# EasyEDA Pro project PokerV2.epro

# Schematic Schematic2

## Sheets
1 ULN2003: Assembly Variant: Basic; Board Name: version 2; Create Date: 2026-07-25; Page Name: ULN2003; Project Name: poker_v2.0; Schematic Name: Schematic2; Update Date: 2026-07-25; Company: 嘉立创EDA; Page Size: A4; Version: V1.0
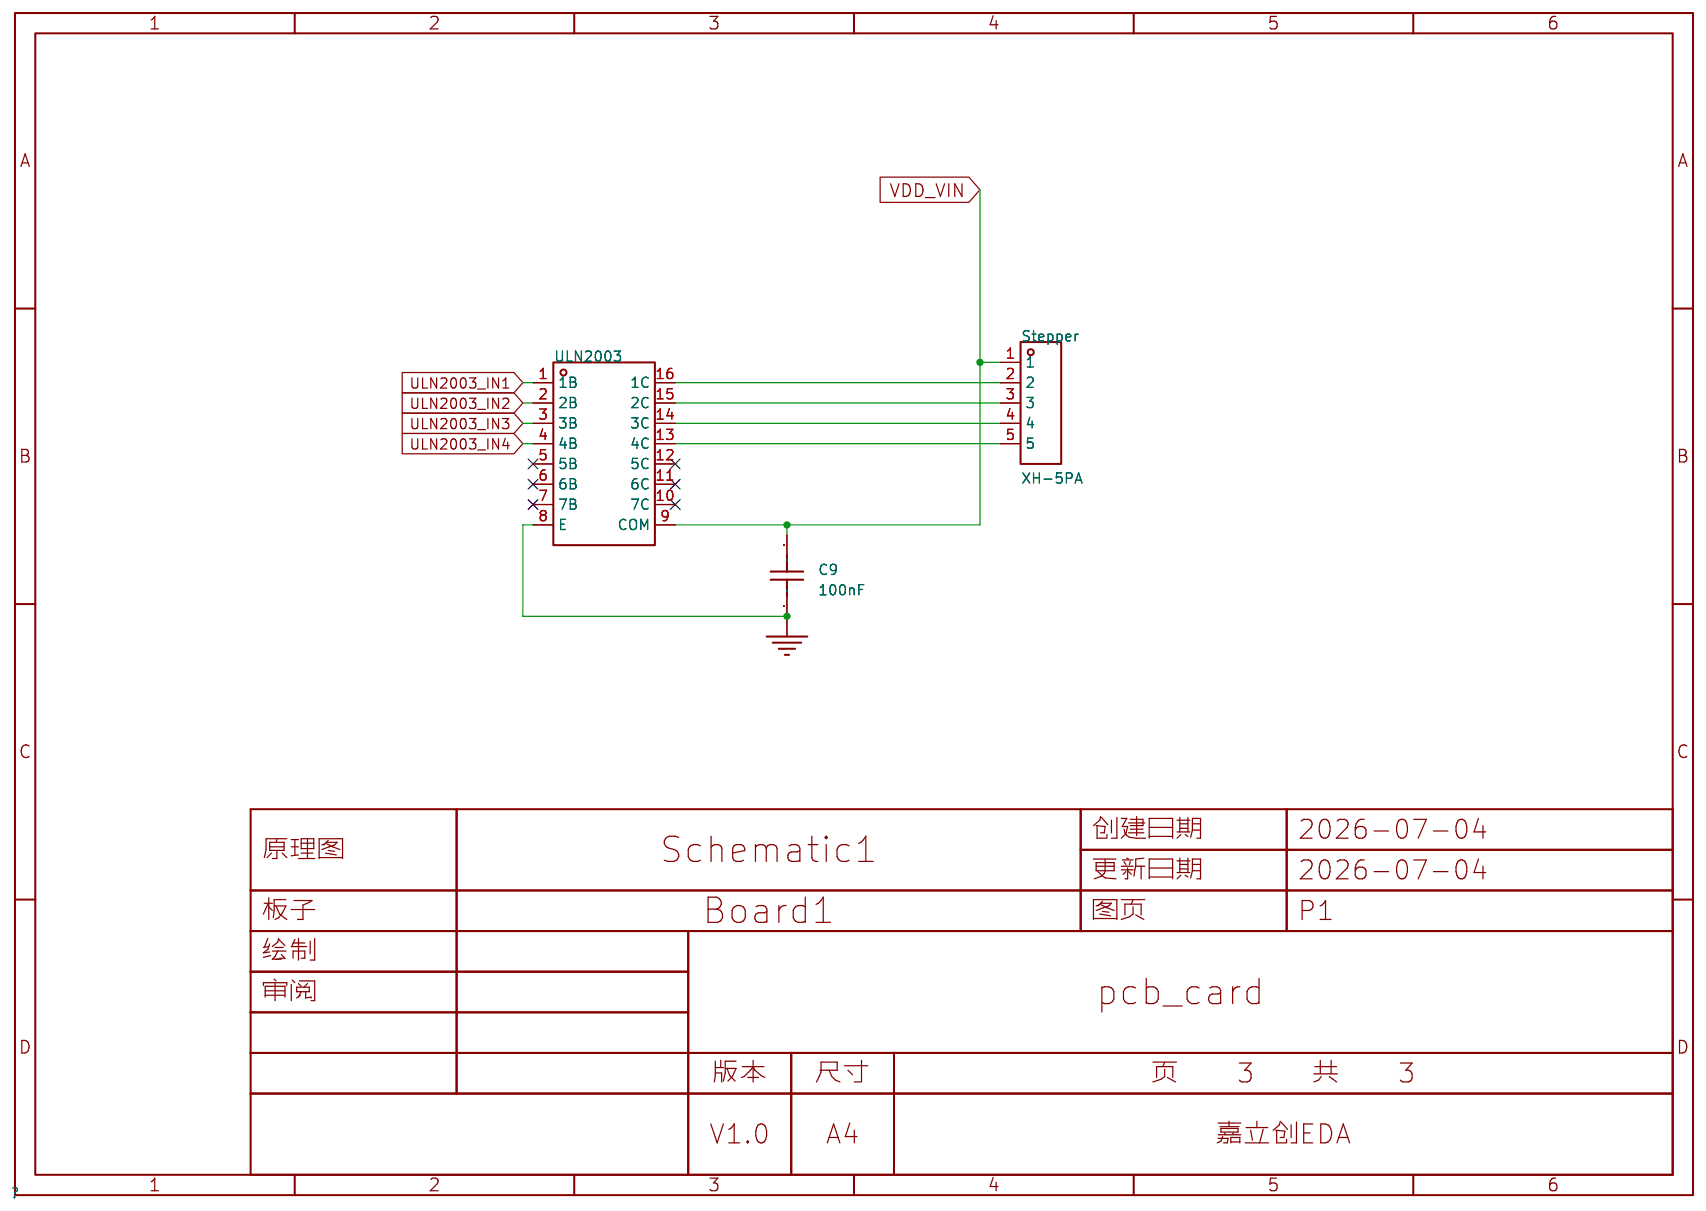
[diagram p0: ULN2003]
2 DRV8833: Page Name: DRV8833; Update Date: 2026-08-29
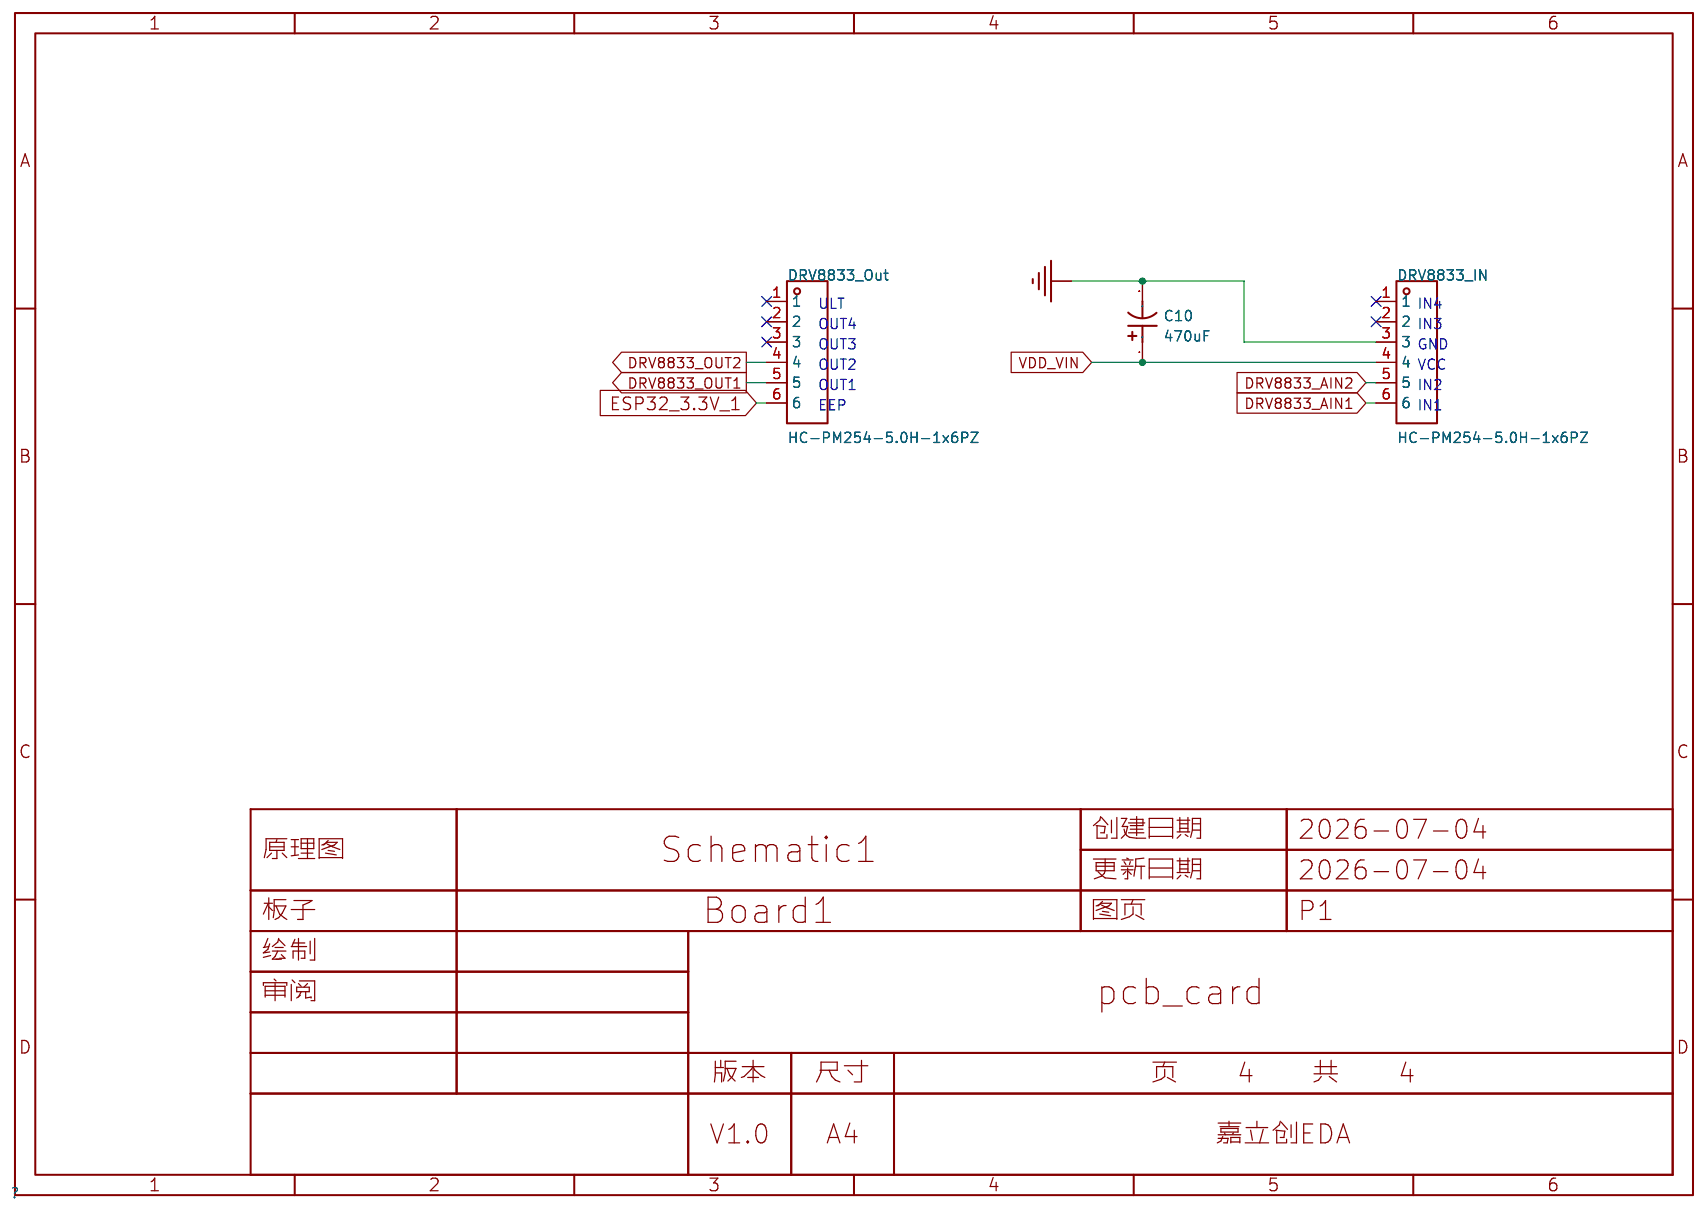
[diagram p1: DRV8833]
3 ESP32-S3N8R2: Page Name: ESP32-S3N8R2; Update Date: 2026-09-03
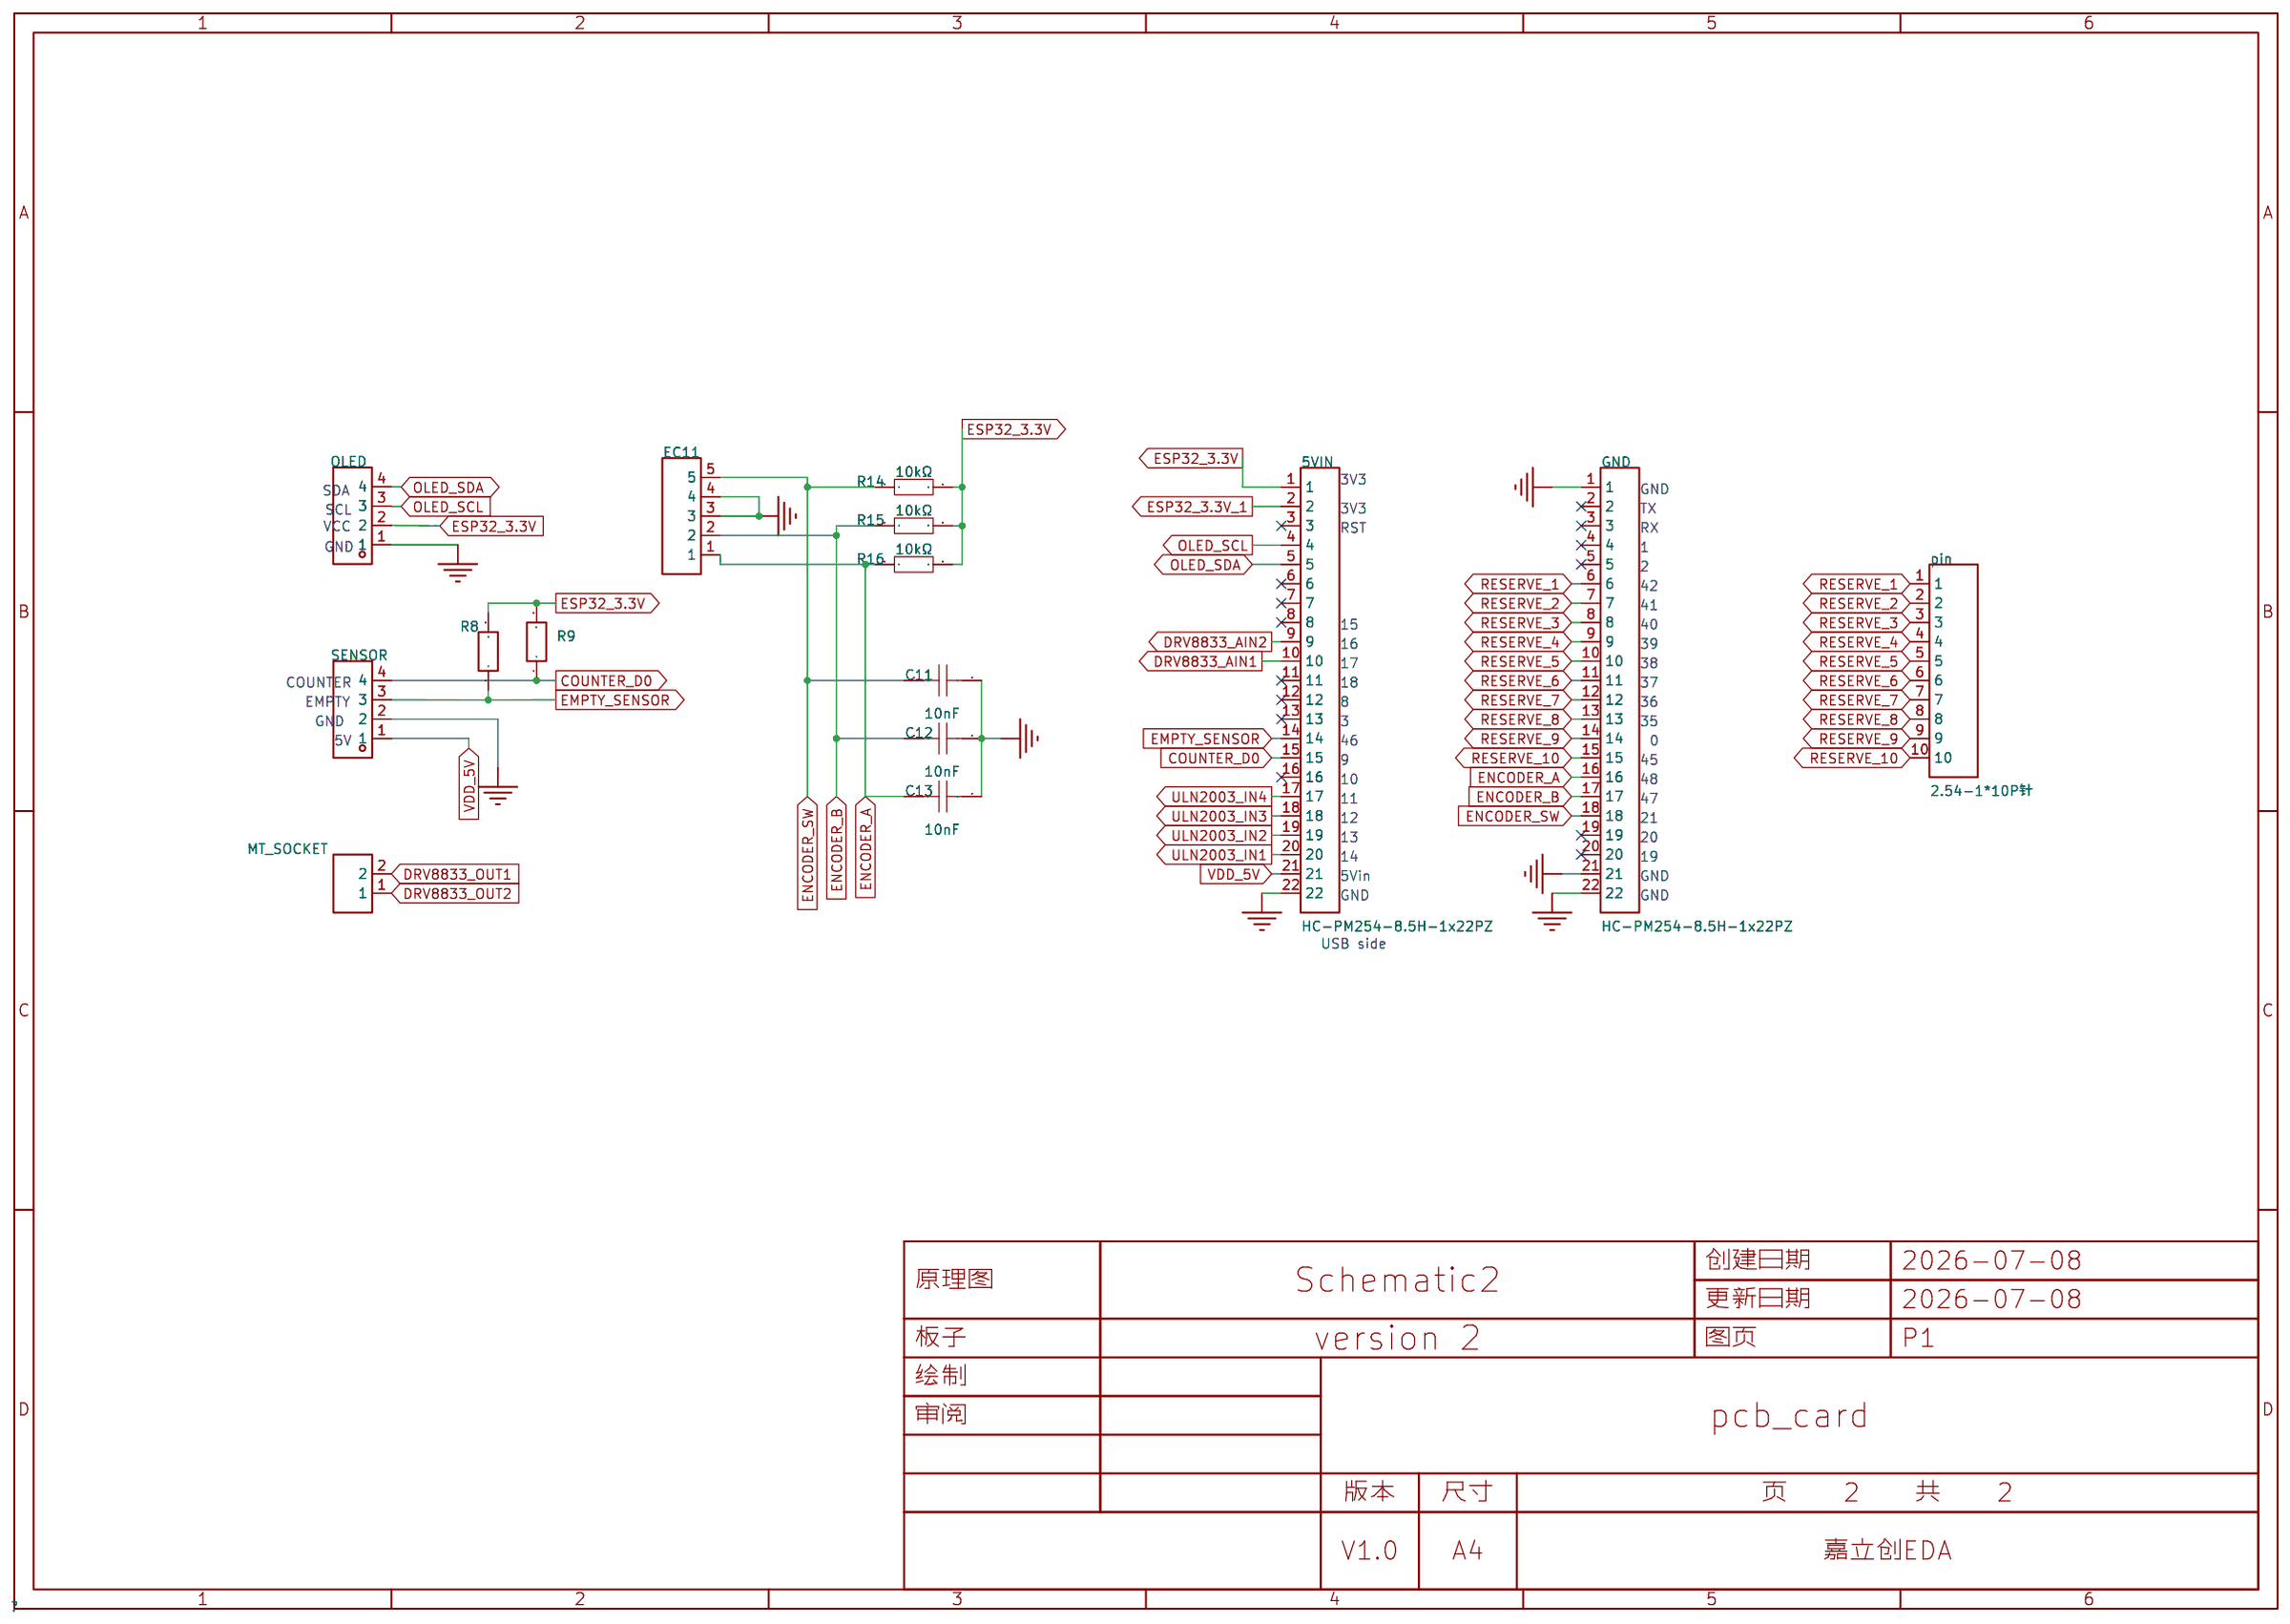
[diagram p2: ESP32-S3N8R2]
4 power: Page Name: power
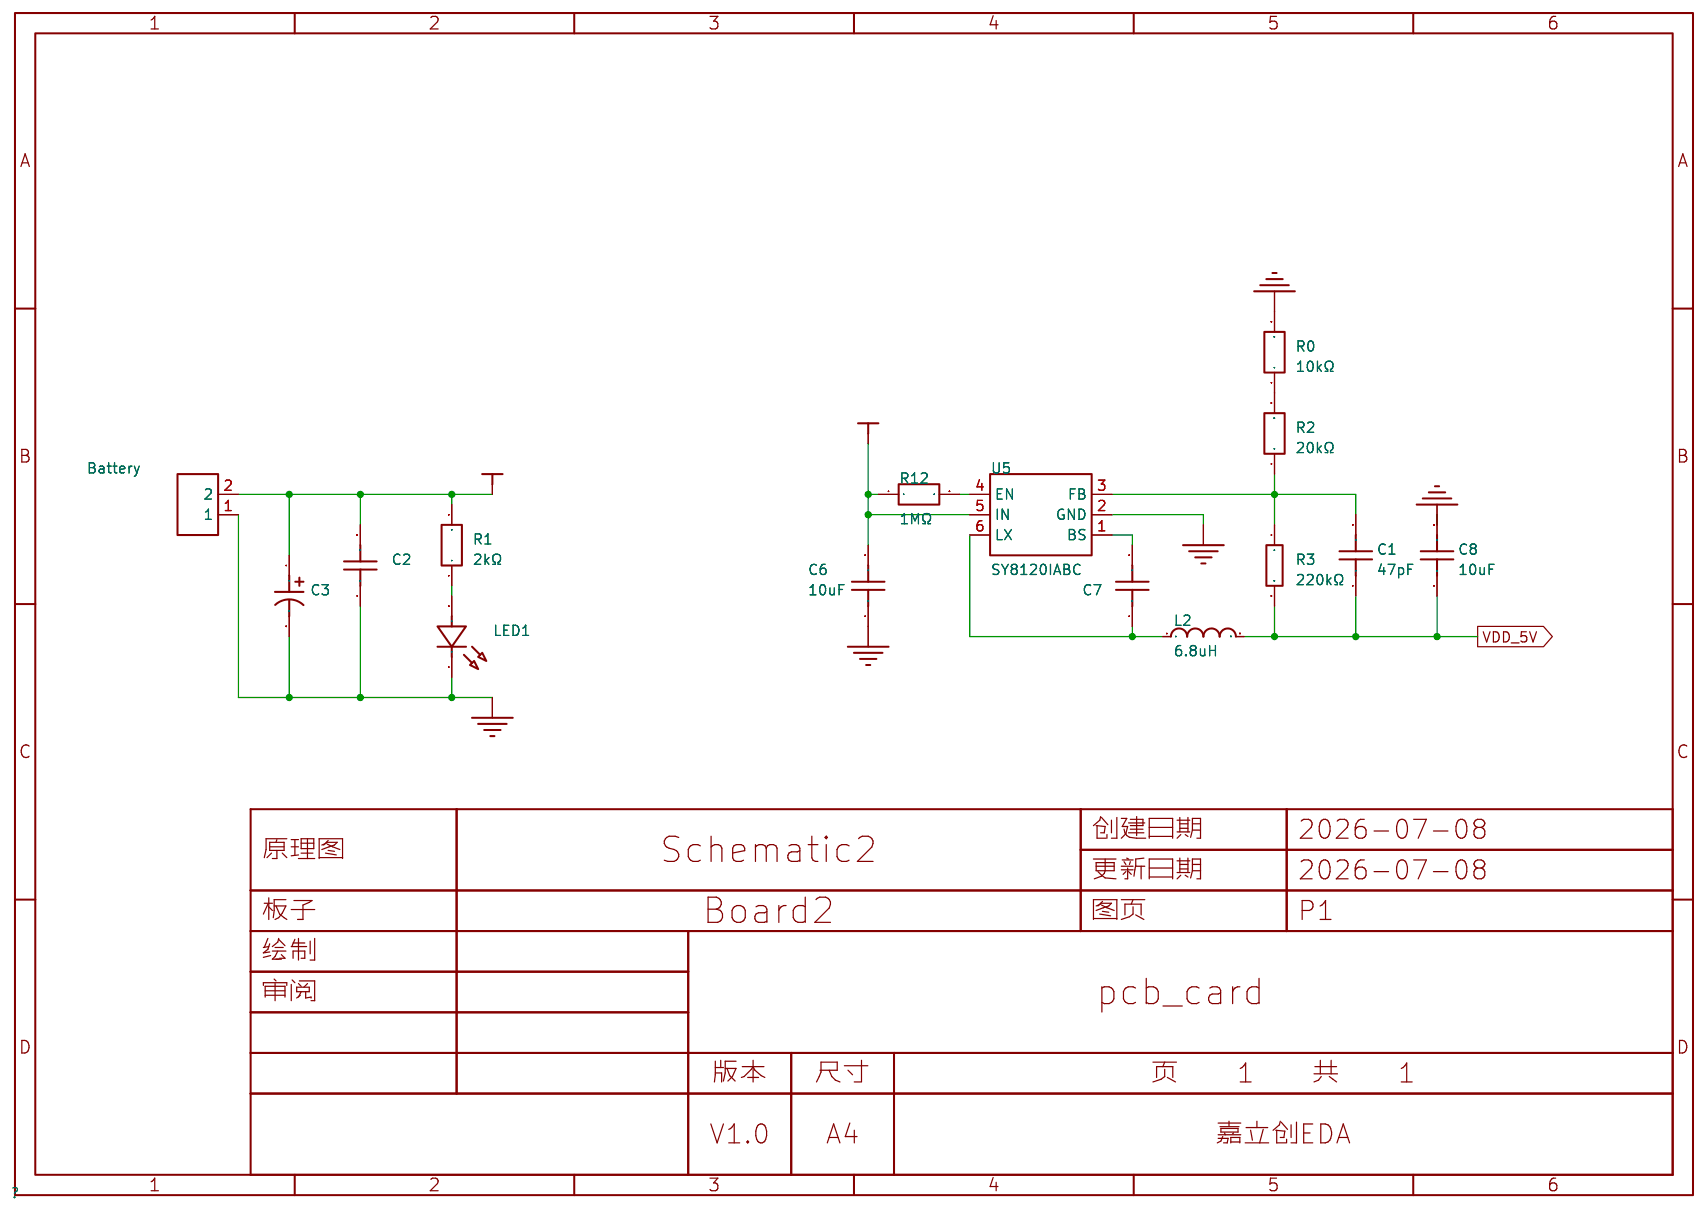
[diagram p3: power]

## Parts
sheet DRV8833
C10  470uF  [CAP-TH_BD8.0-P3.50-D0.6-FD-2]
DRV8833_IN  HC-PM254-5.0H-1x6PZ  [HDR-TH_HC-PM254-5.0H-1X6PZ]
DRV8833_Out  HC-PM254-5.0H-1x6PZ  [HDR-TH_HC-PM254-5.0H-1X6PZ]
sheet ESP32-S3N8R2
5VIN  HC-PM254-8.5H-1x22PZ  [HDR-TH_22P-P2.54-V-F]
C11  10nF  [CAP-TH_L5.8-W3.6-P5.0-D0.6]
C12  10nF  [CAP-TH_L5.8-W3.6-P5.0-D0.6]
C13  10nF  [CAP-TH_L5.8-W3.6-P5.0-D0.6]
EC11  HX-XH2.54-5PZZ  [CONN-TH_5P-P2.50_ZX-XH2.54-5PZZ]
GND  HC-PM254-8.5H-1x22PZ  [HDR-TH_22P-P2.54-V-F]
MT_SOCKET  77311-102-02LF  [HDR-TH_2P-P2.54-V-M-1]
OLED  ZX-XH2.54-4PZZ  [CONN-TH_4P-P2.50_4PIN]
pin  2.54-1*10P针  [HDR-TH_10P-P2.54-V-M-1]
R8  4.7kΩ  [RES-TH_BD2.7-L6.2-P10.20-D0.4]
R9  4.7kΩ  [RES-TH_BD2.7-L6.2-P10.20-D0.4]
R14  10kΩ  [RES-TH_BD2.5-L6.5-P10.50-D0.6]
R15  10kΩ  [RES-TH_BD2.5-L6.5-P10.50-D0.6]
R16  10kΩ  [RES-TH_BD2.5-L6.5-P10.50-D0.6]
SENSOR  ZX-XH2.54-4PZZ  [CONN-TH_4P-P2.50_4PIN]
sheet power
Battery  BX-XH2.54-2PZZ  [CONN-TH_2P-P2.50_BX-XH2.54-2PZZ]
C1  47pF  [CAP-TH_L4.0-W2.6-P2.50-D0.5]
C2  100nF  [CAP-TH_L5.8-W2.4-P2.54-D0.6]
C3  220uF  [CAP-TH_BD6.3-P2.50-D0.5-FD]
C6  10uF  [CAP-TH_L4.0-W2.5-P2.50-D0.5]
C7  100nF  [CAP-TH_L5.8-W2.4-P2.54-D0.6]
C8  10uF  [CAP-TH_L4.0-W2.5-P2.50-D0.5]
L2  6.8uH  [IND-SMD_L5.7-W5.2_GSM0530]
LED1  TLCR5100  [ED-TH_BD5.8-P2.54-R-FD]
R0  10kΩ  [RES-TH_BD2.7-L6.2-P10.20-D0.4]
R1  2kΩ  [RES-TH_BD2.3-L6.5-P10.50-D0.5]
R2  20kΩ  [RES-TH_BD2.3-L6.5-P10.50-D0.5]
R3  220kΩ  [RES-TH_BD2.2-L6.5-P10.50-D0.6]
R12  1MΩ  [RES-TH_BD2.7-L6.2-P10.20-D0.4]
U5  SY8120IABC  [SOT-23-6_L2.9-W1.6-P0.95-LS2.8-BL]
sheet ULN2003
C9  100nF  [CAP-TH_L4.2-W3.5-P2.54-D0.5]
Stepper  XH-5PA  [CONN-TH_5P-P2.50_ZHOURI_XH-5PA]
ULN2003  ULN2003AN(XBLW)  [PDIP-16_L19.3-W6.4-P2.54-LS7.9-BL]

## Library data of the parts
C10 = ERG16V470M8X12: LCSC Part Name: 470uF ±20% 16V; Supplier Part: C47344174; Manufacturer: JIERR(捷而瑞); Supplier Footprint: 插件,D8xL12mm; JLCPCB Part Class: Extended Part; Datasheet: https://item.szlcsc.com/datasheet/ERG16V470M8X12/49556615.html; Supplier: LCSC; Tolerance: ±20%; Voltage Rating: 16V; Ripple Current: 705mA@100kHz; Equivalent Series Resistance(ESR): 100mΩ@100kHz; Pin Spacing: 3.5mm; Diameter: 8mm; Height - Seated (Max): 12mm; Lifetime: 2000hrs@105℃; Operating Temperature: -40℃~+105℃
DRV8833_IN DRV8833_Out = HC-PM254-5.0H-1x6PZ: LCSC Part Name: 间距2.54mm 1x6Pin 直插 PC3.0 H5.0; Supplier Part: C27985231; Manufacturer: HC(虹成电子); Supplier Footprint: 插件,P=2.54mm; JLCPCB Part Class: Extended Part; Datasheet: https://item.szlcsc.com/datasheet/HC-PM254-5.0H-1x6PZ/29721189.html; Supplier: LCSC; Holes Structure: 1x6P; Pitch: 2.54mm; Circular Hole / Square Hole: 方孔; Mounting Type: 直插; Number of Rows: 单排; Number of Positions: 6P; Current Rating: 3A; Holes Direction: 顶部; Insulation Height: 5mm; Contact Material: 黄铜; Contact Plating: 金; Operating Temperature: -40℃~+105℃; PIN Length: 3mm
5VIN GND = HC-PM254-8.5H-1x22PZ: LCSC Part Name: 间距2.54mm 1x22Pin 直插 PC3.0 H8.5; Supplier Part: C41376161; Manufacturer: HC(虹成电子); Supplier Footprint: 插件,P=2.54mm; JLCPCB Part Class: Extended Part; Datasheet: https://item.szlcsc.com/datasheet/HC-PM254-8.5H-1x22PZ/43143860.html; Supplier: LCSC; Holes Structure: 1x22P; Pitch: 2.54mm; Circular Hole / Square Hole: 方孔; Mounting Type: 直插; Number of Rows: 单排; Number of Positions: 22P; Current Rating: 3A; Holes Direction: 顶部; Insulation Height: 8.5mm; Contact Material: 黄铜; Contact Plating: 金; Operating Temperature: -40℃~+105℃; PIN Length: 3mm
C11-C13 = 178MU0008: 容值:10nF;精度:±10%;额定电压:50V;温度系数:X7R;; LCSC Part Name: 10nF ±10% 50V; Supplier Part: C5632432; Manufacturer: KNSCHA(科尼盛); Supplier Footprint: 插件,P=5.08mm; JLCPCB Part Class: Extended Part; Datasheet: https://item.szlcsc.com/datasheet/178MU0008/6552587.html; Supplier: LCSC; Tolerance: ±10%; Voltage Rating: 50V; Temperature Coefficient: X7R
EC11 = HX-XH2.54-5PZZ: 插针结构:1x5P;间距:2.54mm;安装方式:直插;参考系列:XH;总PIN数:5P;排数:1;每排PIN数:5;行距:-;额定电流:3A;触头材质:黄铜;触头镀层:锡;工作温度:-25℃~+85℃;; LCSC Part Name: 1x5P 间距:2.5mm 直插 系列:XH; Supplier Part: C42391663; Manufacturer: hanxia(韩下); Supplier Footprint: 插件,P=2.5mm; JLCPCB Part Class: Extended Part; Datasheet: https://item.szlcsc.com/datasheet/HX-XH2.54-5PZZ/44326935.html; Supplier: LCSC; Pins Structure: 1x5P; Pitch: 2.54mm; Mounting Type: 直插; Reference Series: XH; Number of Pins: 5P; Number of Rows: 1; Number of PINs Per Row: 5; Current Rating: 3A; Contact Material: 黄铜; Contact Plating: 锡; Operating Temperature: -25℃~+85℃; Voltage Rating: 250V; Plastic Material: PA66; Flame Retardant Rating: UL94V-0; Color: 白色
MT_SOCKET = 77311-102-02LF: 插针结构:1x2P;间距:2.54mm;行距:-;圆针/方针:方针;安装方式:直插;排数:单排;总PIN位数:2P;额定电流:3A;额定电压:-;配合针长度:5.84mm;塑高:2.54mm;端接针长度:3.42mm;触头材质:磷青铜;触头镀层:锡;工作温度:-65℃~+125℃;颜色:黑色;; LCSC Part Name: 1x2P 间距:2.54mm 方针 直插; Supplier Part: C180247; Manufacturer: Amphenol; Supplier Footprint: 插件,P=2.54mm; JLCPCB Part Class: Extended Part; Datasheet: https://item.szlcsc.com/datasheet/77311-102-02LF/191642.html; Supplier: LCSC; Pin Structure: 1x2P; Pitch: 2.54mm; Circluar Pins/Square Pins: 方针; Mounting Type: 直插; Number of Rows: 单排; Number of Pins: 2P; Current Rating: 3A; Length of Mating Pin: 5.84mm; Insulation Height: 2.54mm; Length of End Connection Pin: 3.42mm; Contact Material: 磷青铜; Contact Plating: 锡; Operating Temperature: -65℃~+125℃; Color: 黑色
OLED SENSOR = ZX-XH2.54-4PZZ: 插针结构:1x4P;间距:2.5mm;安装方式:直插;参考系列:XH;总PIN数:4P;排数:1;每排PIN数:4;行距:-;额定电流:3A;触头材质:黄铜;触头镀层:锡;工作温度:-25℃~+85℃;; LCSC Part Name: 1x4P 间距:2.5mm 直插 系列:XH; Supplier Part: C7429634; Manufacturer: Megastar(兆星); Supplier Footprint: 插件,P=2.5mm; JLCPCB Part Class: Extended Part; Datasheet: https://item.szlcsc.com/datasheet/ZX-XH2.54-4PZZ/8427551.html; Supplier: LCSC; Pins Structure: 1x4P; Pitch: 2.5mm; Mounting Type: 直插; Reference Series: XH; Number of Pins: 4P; Number of Rows: 1; Number of PINs Per Row: 4; Current Rating: 3A; Contact Material: 黄铜; Contact Plating: 锡; Operating Temperature: -25℃~+85℃; Voltage Rating: 250V; Plastic Material: PA66; Flame Retardant Rating: UL94V-0; Color: 白色; Z-Height of the Board: 7mm; X-Length of Bottom Edge on Board (Spacing Line): 12.5mm; Y-Width of Bottom Edge on Board: 5.9mm
pin = 2.54-1*10P针: LCSC Part Name: 1x10P 间距:2.54mm 方针 直插; Supplier Part: C57369; Manufacturer: BOOMELE(博穆精密); Supplier Footprint: 插件,P=2.54mm; JLCPCB Part Class: Extended Part; Datasheet: https://atta.szlcsc.com/upload/public/pdf/source/20151109/1457707572883.pdf; Supplier: LCSC; Pin Structure: 1x10P; Pitch: 2.54mm; Circluar Pins/Square Pins: 方针; Mounting Type: 直插; Number of Rows: 单排; Number of Pins: 10P; Current Rating: 3A; Operating Temperature: -40℃~+105℃; Color: 黑色
R8 R9 = CR1/4W-4K7±5%-ST52: 电阻类型:碳膜电阻;阻值:4.7kΩ;精度:±5%;功率:250mW;温度系数:±350ppm/℃;; LCSC Part Name: 碳膜电阻 4.7kΩ ±5% 250mW; Supplier Part: C2896834; Manufacturer: VO(翔胜); Supplier Footprint: 插件,D2.7xL6.2mm; JLCPCB Part Class: Extended Part; Datasheet: https://atta.szlcsc.com/upload/public/pdf/source/20210803/C2857407_45FF53FE186CAB545115AD37303966CD.pdf; Supplier: LCSC; Type: 碳膜电阻; Tolerance: ±5%; Overload Voltage (Max): 250V; Power(Watts): 250mW; Temperature Coefficient: ±350ppm/℃; Operating Temperature Range: -55℃~+155℃
R14-R16 = MFR0W4F1002A50: 电阻类型:金属膜电阻;阻值:10kΩ;精度:±1%;功率:250mW;温度系数:±50ppm/℃;; LCSC Part Name: 10kΩ ±1% 250mW 金属膜电阻 铜脚，圆柱状直插; Supplier Part: C57436; Manufacturer: UNI-ROYAL(厚声); Supplier Footprint: 插件,D2.2xL6.5mm; JLCPCB Part Class: Extended Part; Datasheet: https://atta.szlcsc.com/upload/public/pdf/source/20191012/C436293_8820AA14BC71FA35E551C06C441482A0.pdf; Supplier: LCSC; Type: 金属膜电阻; Tolerance: ±1%; Voltage-Supply(Max): 250V; Power(Watts): 250mW; Temperature Coefficient: ±50ppm/℃
Battery = BX-XH2.54-2PZZ: 插针结构:1x2P;间距:2.5mm;安装方式:直插;参考系列:XH;总PIN数:2P;排数:1;每排PIN数:2;行距:-;额定电流:3A;触头材质:黄铜;触头镀层:锡;工作温度:-25℃~+85℃;; LCSC Part Name: 1x2P 间距:2.5mm 直插 系列:XH; Supplier Part: C18077833; Manufacturer: Bossie(博锡); Supplier Footprint: 插件,P=2.54mm; JLCPCB Part Class: Extended Part; Datasheet: https://item.szlcsc.com/datasheet/BX-XH2.54-2PZZ/19218234.html; Supplier: LCSC; Pins Structure: 1x2P; Pitch: 2.5mm; Mounting Type: 直插; Reference Series: XH; Number of Pins: 2P; Number of Rows: 1; Number of PINs Per Row: 2; Current Rating: 3A; Contact Material: 黄铜; Contact Plating: 锡; Operating Temperature: -25℃~+85℃; Voltage Rating: 250V; Plastic Material: PA66; Flame Retardant Rating: UL94V-0; Color: 白色; Z-Height of the Board: 7mm; X-Length of Bottom Edge on Board (Spacing Line): 7.5mm; Y-Width of Bottom Edge on Board: 5.9mm
C1 = K470J15C0GF5TL2: 容值:47pF;精度:±5%;额定电压:50V;温度系数:C0G;; LCSC Part Name: 47pF ±5% 50V; Supplier Part: C2170192; Manufacturer: VISHAY(威世); Supplier Footprint: 插件,P=2.5mm; JLCPCB Part Class: Extended Part; Datasheet: https://item.szlcsc.com/datasheet/K470J15C0GF5TL2/2262257.html; Supplier: LCSC; Tolerance: ±5%; Voltage Rating: 50V; Temperature Coefficient: C0G; Pin Spacing: 2.5mm
C2 C7 = CC1H104ZA1ED3F5P1100: 容值:100nF;精度:-20%~+80%;额定电压:50V;温度系数:Y5V;; LCSC Part Name: 100nF -20%~+80% 50V; Supplier Part: C2832506; Manufacturer: Dersonic(德尔创); Supplier Footprint: 插件,P=2.54mm; JLCPCB Part Class: Extended Part; Datasheet: https://item.szlcsc.com/datasheet/CC1H104ZA1ED3F5P1100/2990644.html; Supplier: LCSC; Tolerance: -20%~+80%; Voltage Rating: 50V; Pin Spacing: 2.54mm; Temperature Coefficient: Y5V; Diameter: 5.8mm; Body Thickness: 2.4mm
C3 = ERG25V220M6X11: 容值:220uF;精度:±20%;额定电压:25V;纹波电流:510mA@100kHz;等效串联电阻(ESR):130mΩ@100kHz;; LCSC Part Name: 220uF ±20% 25V; Supplier Part: C47344177; Manufacturer: JIERR(捷而瑞); Supplier Footprint: 插件,D6.3xL11mm; JLCPCB Part Class: Extended Part; Datasheet: https://item.szlcsc.com/datasheet/ERG25V220M6X11/49556618.html; Supplier: LCSC; Tolerance: ±20%; Voltage Rating: 25V; Ripple Current: 510mA@100kHz; Equivalent Series Resistance(ESR): 130mΩ@100kHz; Pin Spacing: 2.5mm; Diameter: 6mm; Height - Seated (Max): 11mm; Lifetime: 2000hrs@105℃; Operating Temperature: -40℃~+105℃
C6 C8 = FG18X5R1E106MRT06: LCSC Part Name: 10uF ±20% 25V; Supplier Part: C1623673; Manufacturer: TDK; Supplier Footprint: 插件; JLCPCB Part Class: Extended Part; Datasheet: https://item.szlcsc.com/datasheet/FG18X5R1E106MRT06/1714519.html; Supplier: LCSC; Tolerance: ±20%; Voltage Rating: 25V; Temperature Coefficient: X5R
L2 = SRG0530-6R8-M: LCSC Part Name: 6.8μH ±20% 4A; Supplier Part: C53462977; Manufacturer: JIERR(捷而瑞); Supplier Footprint: SMD,5.7x5.2mm; JLCPCB Part Class: Extended Part; Datasheet: https://item.szlcsc.com/datasheet/SRG0530-6R8-M/56628172.html; Supplier: LCSC; Tolerance: ±20%; Current Rating: 3.5A; Current - Saturation(Isat): 4A; DC Resistance(DCR): 86mΩ; Type: 一体成型电感
LED1 = TLCR5100: 灯头类型:-;发光颜色:红色;正向压降(Vf):2.1V;功率:135mW;正向电流:50mA;波长:611nm~622nm;二极管配置:独立二极管;透镜颜色:无色透明透镜;色温:-;发光强度:11cd;发光角度:18°;载带方式:-;工作温度:-40℃~+100℃;; LCSC Part Name: 超亮LED，0.5 mm无色透明非漫射封装; Supplier Part: C7069388; Manufacturer: VISHAY(威世); Supplier Footprint: 插件; JLCPCB Part Class: Extended Part; Datasheet: https://item.szlcsc.com/datasheet/TLCR5100/8035999.html; Supplier: LCSC; Illumination Color: 红色; Voltage - Forward(Vf): 2.1V; Power(Watts): 135mW; Forward Current: 50mA; Wavelength - Dominant: 611nm~622nm; Peak Wavelength: 622nm; Diode Configuration: 独立二极管; Lens Color: 无色透明透镜; Luminous Intensity: 11cd; Viewing Angle: 18°; Operating Temperature: -40℃~+100℃
R0 = MF1/4W-10K±1%-ST52: 电阻类型:金属膜电阻;阻值:10kΩ;精度:±1%;功率:250mW;温度系数:±100ppm/℃;; LCSC Part Name: 金属膜电阻 10kΩ ±1% 250mW; Supplier Part: C2903232; Manufacturer: VO(翔胜); Supplier Footprint: 插件,D2.7xL6.2mm; JLCPCB Part Class: 扩展库; Datasheet: https://item.szlcsc.com/datasheet/MF1%252F4W-10K%25C2%25B11%2525-ST52/3158983.html; Supplier: LCSC; Type: 金属膜电阻; Tolerance: ±1%; Voltage-Supply(Max): 250V; Power(Watts): 250mW; Temperature Coefficient: ±100ppm/℃; Operating Temperature: -55℃~+155℃
R1 = MF1/4W-2KΩ±1%T52: LCSC Part Name: 金属膜电阻 2kΩ ±1% 250mW; Supplier Part: C714001; Manufacturer: 华星机电; Supplier Footprint: 插件,D2.3xL6.5mm; JLCPCB Part Class: Extended Part; Datasheet: https://item.szlcsc.com/datasheet/MF1%252F4W-2K%25CE%25A9%25C2%25B11%2525T52/754326.html; Supplier: LCSC; Type: 金属膜电阻; Tolerance: ±1%; Power(Watts): 250mW; Temperature Coefficient: ±200ppm/℃
R2 = MF1/4W-220KΩ±1% T: 电阻类型:金属膜电阻;阻值:220kΩ;精度:±1%;功率:250mW;温度系数:±100ppm/℃;; LCSC Part Name: 220kΩ ±1% 250mW 金属膜电阻 圆柱状直插; Supplier Part: C119374; Manufacturer: CCO(千志电子); Supplier Footprint: 插件,D2.3xL6.5mm; JLCPCB Part Class: Extended Part; Datasheet: https://item.szlcsc.com/datasheet/MF1%252F4W-220K%25CE%25A9%25C2%25B11%2525%2520T/120643.html; Supplier: LCSC; Type: 金属膜电阻; Tolerance: ±1%; Voltage-Supply(Max): 250V; Power(Watts): 250mW; Temperature Coefficient: ±100ppm/℃; Operating Temperature: -55℃~+155℃
R3 = MFR0W4F3002A50: 电阻类型:金属膜电阻;阻值:30kΩ;精度:±1%;功率:250mW;温度系数:±50ppm/℃;; LCSC Part Name: 30kΩ ±1% 250mW 金属膜电阻 铜脚，圆柱状直插; Supplier Part: C58652; Manufacturer: UNI-ROYAL(厚声); Supplier Footprint: 插件,D2.2xL6.5mm; JLCPCB Part Class: Extended Part; Datasheet: https://item.szlcsc.com/datasheet/MFR0W4F3002A50/59697.html; Supplier: LCSC; Type: 金属膜电阻; Tolerance: ±1%; Voltage-Supply(Max): 250V; Power(Watts): 250mW; Temperature Coefficient: ±50ppm/℃
R12 = MF1/4W-1M±1%-OT52: LCSC Part Name: 金属膜电阻 1MΩ ±1% 250mW; Supplier Part: C2903250; Manufacturer: VO(翔胜); Supplier Footprint: 插件,D2.7xL6.2mm; JLCPCB Part Class: Extended Part; Datasheet: https://atta.szlcsc.com/upload/public/pdf/source/20200609/C601728_5AA4C0C8E12E11069DA2C3356F29D1F2.pdf; Supplier: LCSC; Type: 金属膜电阻; Tolerance: ±1%; Overload Voltage (Max): 250V; Power(Watts): 250mW; Temperature Coefficient: ±100ppm/℃; Operating Temperature Range: -55℃~+155℃
U5 = SY8120IABC: LCSC Part Name: 降压型 2A 4.2V~18V; Supplier Part: C479076; Manufacturer: Silergy(矽力杰); Supplier Footprint: SOT-23-6; JLCPCB Part Class: Extended Part; Datasheet: https://item.szlcsc.com/datasheet/SY8120IABC/486368.html; Supplier: LCSC; Function: 降压型; Voltage - Supply: 4.2V~18V; Output Current: 2A; Frequency - Switching: 500kHz; Operating Temperature: -40℃~+125℃@(TJ)；-40℃~+85℃@(TA); Synchronous Rectifier: 是; Number of Outputs: 1; Topology: 降压式; Quiescent Current: 200uA; Switch tube (built-in/external): 内置; Output Type: 可调; Features: 轻载高效模式；逐波限流；过流保护；打嗝限流
C9 = 178MU0006: 容值:100nF;精度:±10%;额定电压:50V;温度系数:X7R;; LCSC Part Name: 100nF ±10% 50V; Supplier Part: C5632430; Manufacturer: KNSCHA(科尼盛); Supplier Footprint: 插件,P=2.54mm; JLCPCB Part Class: Extended Part; Datasheet: https://item.szlcsc.com/datasheet/178MU0006/6552585.html; Supplier: LCSC; Tolerance: ±10%; Voltage Rating: 50V; Temperature Coefficient: X7R; Pin Spacing: 2.54mm
Stepper = XH-5PA: LCSC Part Name: 1x5P 间距:2.5mm 直插; Supplier Part: C5258886; Manufacturer: ZHOURI(洲日); Supplier Footprint: 插件,P=2.5mm; JLCPCB Part Class: Extended Part; Datasheet: https://item.szlcsc.com/datasheet/XH-5PA/5978917.html; Supplier: LCSC; Pins Structure: 1x5P; Pitch: 2.5mm; Mounting Type: 直插; Number of Pins: 5P; Number of Rows: 1; Number of PINs Per Row: 5; Current Rating: 3A; Operating Temperature: -25℃~+85℃; Voltage Rating: 250V; Plastic Material: PA66; Z-Height of the Board: 7mm; X-Length of Bottom Edge on Board (Spacing Line): 15mm; Y-Width of Bottom Edge on Board: 5.7mm
ULN2003 = ULN2003AN(XBLW): 通道数:七路;集射击穿电压(Vceo):50V;集电极电流(Ic):500mA;; LCSC Part Name: ULN2003AN; Supplier Part: C18723564; Manufacturer: XBLW(芯伯乐); Supplier Footprint: DIP-16; JLCPCB Part Class: Extended Part; Datasheet: https://item.szlcsc.com/datasheet/ULN2003AN(XBLW)/19916691.html; Supplier: LCSC; number of channels: 七路; Collector - Emitter Voltage VCEO: 50V; Current - Collector(Ic): 500mA; Voltage - Input(Max): 30V

## Nets
GND: 5VIN.22 Battery.1 C2.1 C3.2 C6.1 C8.2 C9.1 C10.2 C11.2 C12.2 C13.2 DRV8833_IN.3 EC11.3 EC11.4 GND.1 GND.21 GND.22 LED1.1(K) OLED.1 R0.2 SENSOR.2 U5.2(GND) ULN2003.8(E)
VDD_5V: 5VIN.21 C1.1 C8.1 L2.2 R3.2 SENSOR.1
VDD_VIN: Battery.2 C2.2 C3.1 C6.2 C9.2 C10.1 DRV8833_IN.4 R1.2 R12.1 Stepper.1 U5.5(IN) ULN2003.9(COM)
COUNTER_D0: 5VIN.15 R9.1 SENSOR.4
DRV8833_AIN1: 5VIN.10 DRV8833_IN.6
DRV8833_AIN2: 5VIN.9 DRV8833_IN.5
DRV8833_OUT1: DRV8833_Out.5 MT_SOCKET.2
DRV8833_OUT2: DRV8833_Out.4 MT_SOCKET.1
EMPTY_SENSOR: 5VIN.14 R8.1 SENSOR.3
ENCODER_A: C13.1 EC11.1 GND.16 R16.1
ENCODER_B: C12.1 EC11.2 GND.17 R15.1
ENCODER_SW: C11.1 EC11.5 GND.18 R14.1
ESP32_3.3V: 5VIN.1 OLED.2 R8.2 R9.2 R14.2 R15.2 R16.2
ESP32_3.3V_1: 5VIN.2 DRV8833_Out.6
OLED_SCL: 5VIN.4
OLED_SDA: 5VIN.5 OLED.4
RESERVE_1: GND.6 pin.1
RESERVE_2: GND.7 pin.2
RESERVE_3: GND.8 pin.3
RESERVE_4: GND.9 pin.4
RESERVE_5: GND.10 pin.5
RESERVE_6: GND.11 pin.6
RESERVE_7: GND.12 pin.7
RESERVE_8: GND.13 pin.8
RESERVE_9: GND.14 pin.9
RESERVE_10: GND.15 pin.10
ULN2003_IN1: 5VIN.20 ULN2003.1(1B)
ULN2003_IN2: 5VIN.19 ULN2003.2(2B)
ULN2003_IN3: 5VIN.18 ULN2003.3(3B)
ULN2003_IN4: 5VIN.17 ULN2003.4(4B)
$1N9: Stepper.5 ULN2003.13(4C)
$1N11: Stepper.4 ULN2003.14(3C)
$1N12: Stepper.3 ULN2003.15(2C)
$1N13: Stepper.2 ULN2003.16(1C)
$4N6: LED1.2(A) R1.1
$4N17: R12.2 U5.4(EN)
$4N20: C1.2 R2.1 R3.1 U5.3(FB)
$4N23: C7.1 L2.1 U5.6(LX)
$4N24: C7.2 U5.1(BS)
$4N2655: R0.1 R2.2

Not connected (* = marked no-connect by the designer): 5VIN 3* 6* 7* 8* 11* 12* 13* 16*; DRV8833_IN 1* 2*; DRV8833_Out 1* 2* 3*; GND 2* 3* 4* 5* 19* 20*; OLED 3; ULN2003 5(5B)* 6(6B)* 7(7B)* 10(7C)* 11(6C)* 12(5C)*

## Notes on the sheets
sheet 2
- ULT
- IN4
- OUT3
- OUT4
- GND
- IN3
- OUT2
- VCC
- OUT1
- IN2
- EEP
- IN1
sheet 3
- SDA
- 3V3
- GND
- SCL
- 3V3
- TX
- VCC
- RST
- RX
- GND
- 1
- 2
- 42
- 41
- 15
- 40
- 16
- 39
- 17
- 38
- COUNTER
- EMPTY
- 18
- 8
- 36
- 37
- GND
- 3
- 35
- 5V
- 46
- 0
- 9
- 45
- 10
- 48
- 11
- 47
- 12
- 13
- 20
- 21
- 14
- 19
- 5Vin
- GND
- GND
- GND
- USB side

# Board PCB2
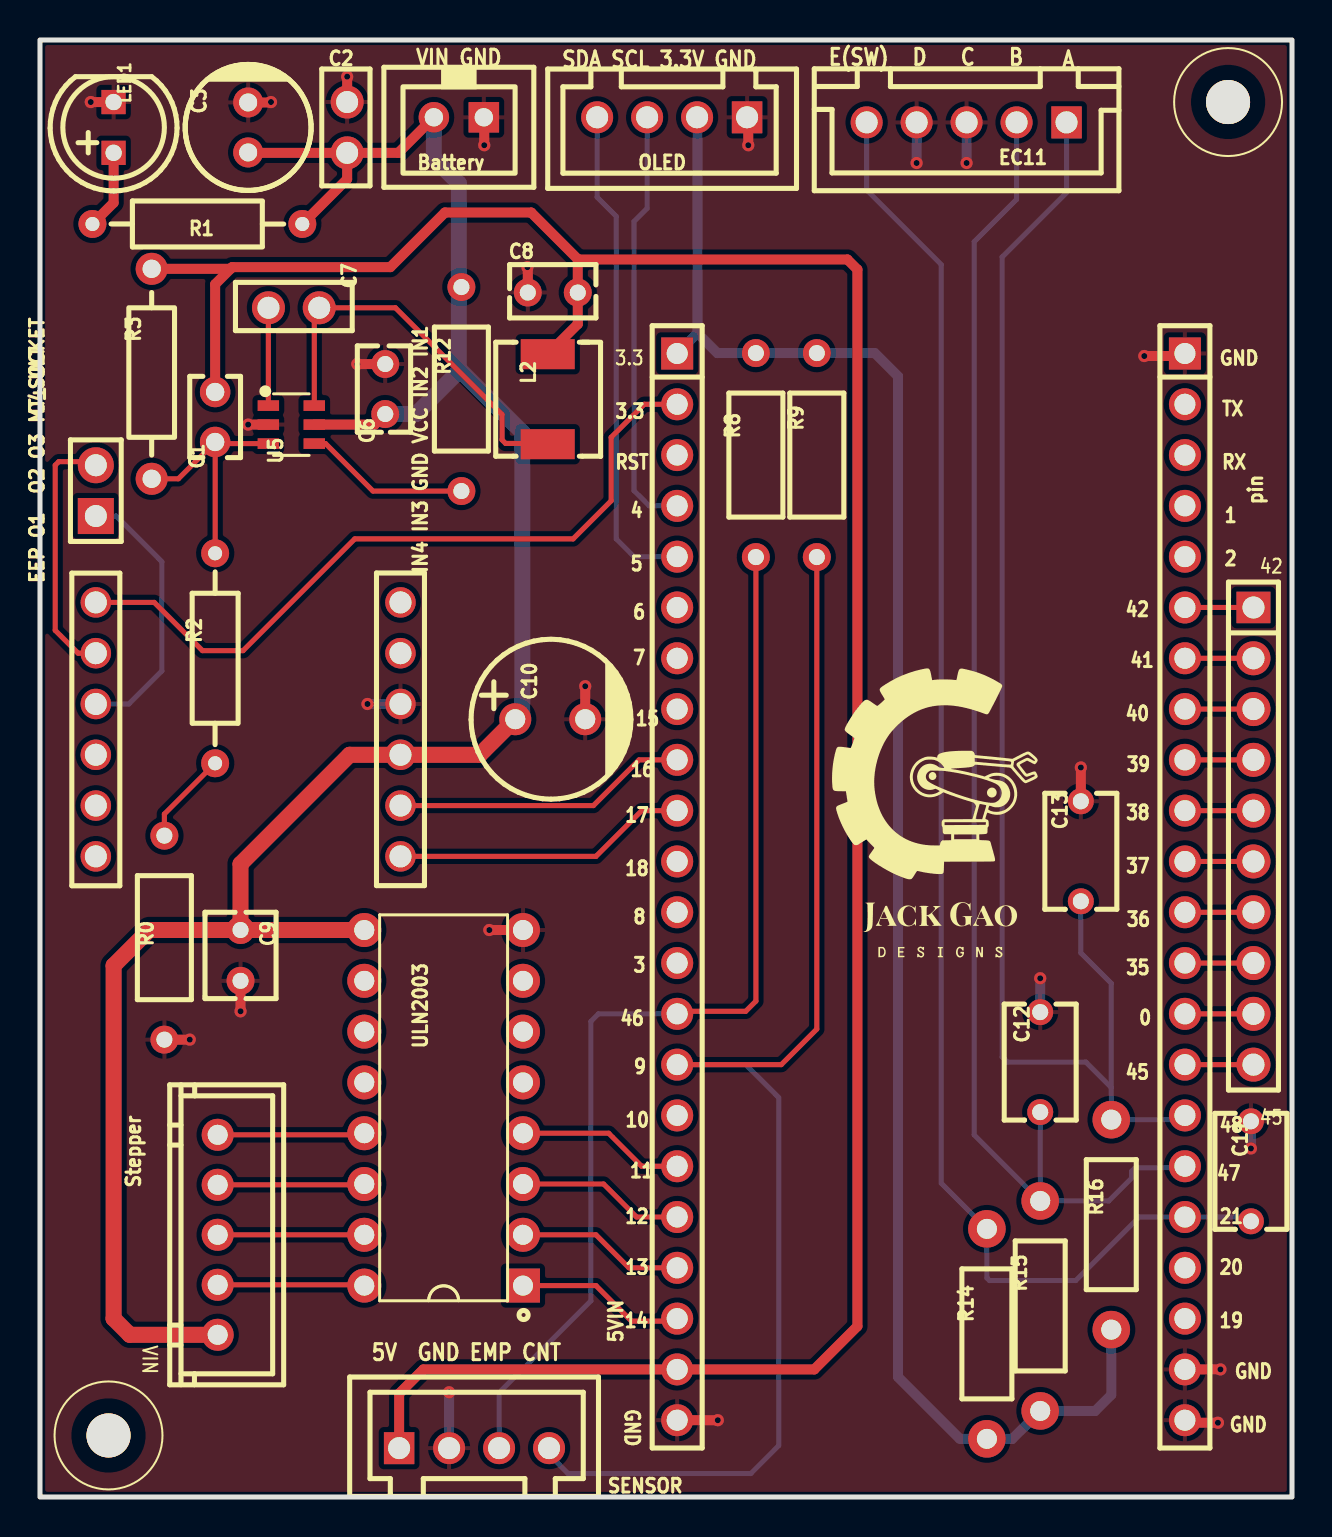
[diagram p4: board, top side]
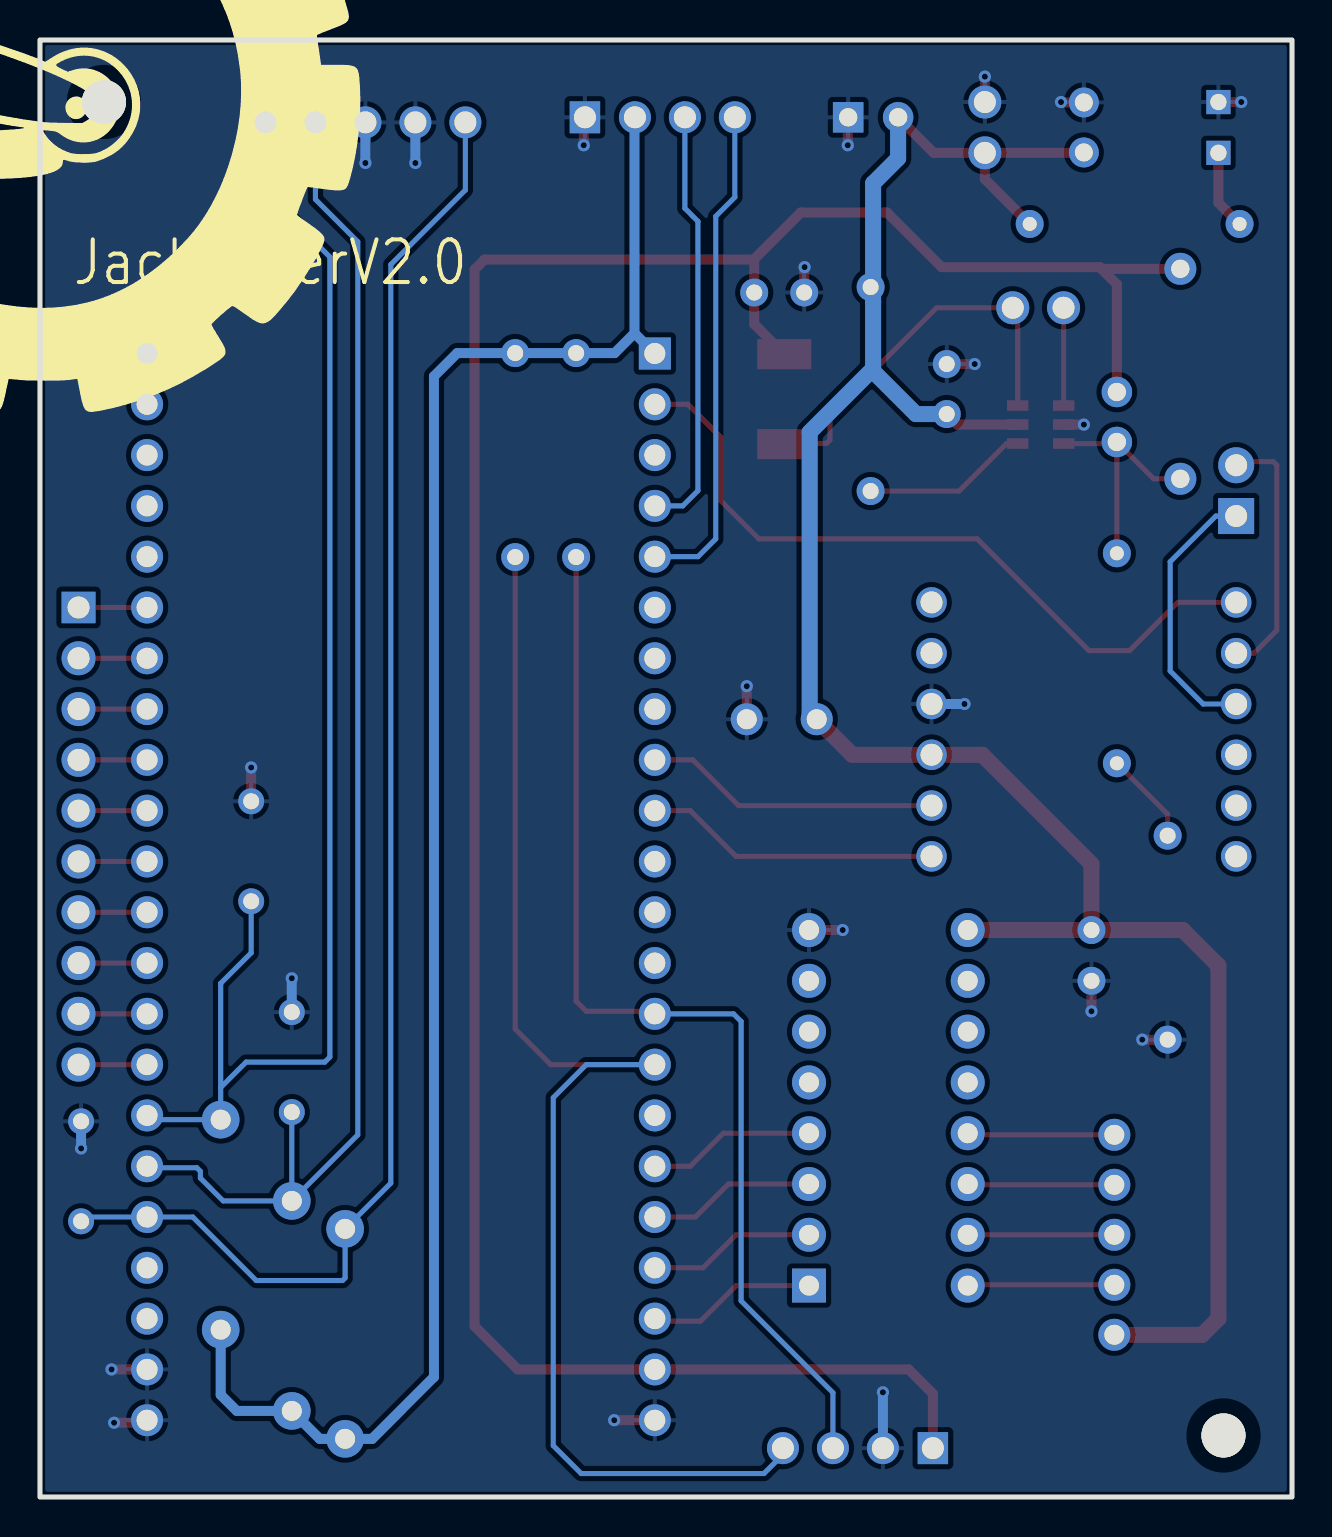
[diagram p5: board, bottom side, seen from below]

Outline 62.63 x 72.86 mm; copper layers: Top Layer, Bottom Layer. Coordinates in mm from the lower left corner of the outline.
Outline path: rectangle 0,72.86 62.63,0
Stack: Top Layer 0.035mm / Dielectric1 1.51mm FR4 er 4.5 / Bottom Layer 0.035mm

## Design rules (mm)
spacing copperThickness1oz (default): track to track 0.102, other pairs 0.152 to 0.3
spacing copperThickness2oz: track to track 0.203, other pairs 0.152 to 0.3
track width copperThickness1oz (default): min 0.127, default 0.254, max 2.54
track width copperThickness2oz: min 0.203, default 0.254, max 2.54
track width power: min 0.5, default 0.5, max 2.54
differential pair differentialPair (default): width min 0.127, default 0.254, max 2.54; gap min 0.152, default 0.152
via viaSize (default): diameter min 0.5, default 0.61, max 10; hole min 0.3, default 0.305, max 6.3
net ESP32_3.3V uses power
net GND uses power
net VDD_5V uses power
net VDD_VIN uses power

## Placement (name value [footprint] x y rotation side)
5VIN  HC-PM254-8.5H-1x22PZ  [HDR-TH_22P-P2.54-V-F]  31.88 30.51 270 top
Battery  BX-XH2.54-2PZZ  [CONN-TH_2P-P2.50_BX-XH2.54-2PZZ]  20.96 68.99 180 top
C1  47pF  [CAP-TH_L4.0-W2.6-P2.50-D0.5]  8.76 54 270 top
C2  100nF  [CAP-TH_L5.8-W2.4-P2.54-D0.6]  15.37 68.48 270 top
C3  220uF  [CAP-TH_BD6.3-P2.50-D0.5-FD]  10.41 68.48 90 top
C6  10uF  [CAP-TH_L4.0-W2.5-P2.50-D0.5]  17.27 55.4 270 top
C7  100nF  [CAP-TH_L5.8-W2.4-P2.54-D0.6]  12.7 59.47 180 top
C8  10uF  [CAP-TH_L4.0-W2.5-P2.50-D0.5]  25.65 60.23 180 top
C9  100nF  [CAP-TH_L4.2-W3.5-P2.54-D0.5]  10.03 27.08 90 top
C10  470uF  [CAP-TH_BD8.0-P3.50-D0.6-FD-2]  25.53 38.89 0 top
C11  10nF  [CAP-TH_L5.8-W3.6-P5.0-D0.6]  60.58 16.29 90 top
C12  10nF  [CAP-TH_L5.8-W3.6-P5.0-D0.6]  50.04 21.75 90 top
C13  10nF  [CAP-TH_L5.8-W3.6-P5.0-D0.6]  52.07 32.29 90 top
EC11  HX-XH2.54-5PZZ  [CONN-TH_5P-P2.50_ZX-XH2.54-5PZZ]  46.35 68.74 180 top
EEP O1  O2 O3  O4 ULT  -  [HDR-TH_HC-PM254-5.0H-1X6PZ]  2.79 38.38 90 top
GND  HC-PM254-8.5H-1x22PZ  [HDR-TH_22P-P2.54-V-F]  57.28 30.51 270 top
IN4 IN3 GND VCC IN2 IN1  HC-PM254-5.0H-1x6PZ  [HDR-TH_HC-PM254-5.0H-1X6PZ]  18.03 38.38 270 top
L2  6.8uH  [IND-SMD_L5.7-W5.2_GSM0530]  25.4 54.89 90 top
LED1  TLCR5100  [ED-TH_BD5.8-P2.54-R-FD]  3.68 68.48 90 top
MT_SOCKET  77311-102-02LF  [HDR-TH_2P-P2.54-V-M-1]  2.79 50.32 90 top
NOREF  -  [Pad_e372]  3.43 3.08 0 top
NOREF#2  -  [Pad_e331]  59.44 69.75 0 top
OLED  ZX-XH2.54-4PZZ  [CONN-TH_4P-P2.50_4PIN]  31.62 68.99 180 top
pin  2.54-1*10P针  [HDR-TH_10P-P2.54-V-M-1]  60.71 33.05 270 top
R0  10kΩ  [RES-TH_BD2.7-L6.2-P10.20-D0.4]  6.22 27.97 270 top
R1  2kΩ  [RES-TH_BD2.3-L6.5-P10.50-D0.5]  7.87 63.66 0 top
R2  20kΩ  [RES-TH_BD2.3-L6.5-P10.50-D0.5]  8.76 41.94 270 top
R3  220kΩ  [RES-TH_BD2.2-L6.5-P10.50-D0.6]  5.59 56.16 90 top
R8  4.7kΩ  [RES-TH_BD2.7-L6.2-P10.20-D0.4]  35.81 52.1 90 top
R9  4.7kΩ  [RES-TH_BD2.7-L6.2-P10.20-D0.4]  38.86 52.1 90 top
R12  1MΩ  [RES-TH_BD2.7-L6.2-P10.20-D0.4]  21.08 55.4 270 top
R14  10kΩ  [RES-TH_BD2.5-L6.5-P10.50-D0.6]  47.37 8.16 270 top
R15  10kΩ  [RES-TH_BD2.5-L6.5-P10.50-D0.6]  50.04 9.56 270 top
R16  10kΩ  [RES-TH_BD2.5-L6.5-P10.50-D0.6]  53.59 13.62 270 top
SENSOR  ZX-XH2.54-4PZZ  [CONN-TH_4P-P2.50_4PIN]  21.72 2.44 0 top
Stepper  XH-5PA  [CONN-TH_5P-P2.50_ZHOURI_XH-5PA]  8.89 13.11 90 top
U5  SY8120IABC  [SOT-23-6_L2.9-W1.6-P0.95-LS2.8-BL]  12.57 53.62 270 top
ULN2003  ULN2003AN(XBLW)  [PDIP-16_L19.3-W6.4-P2.54-LS7.9-BL]  20.19 19.46 90 top

## Footprints (pads in the part's own frame, mm; a bottom-side part is the same pattern mirrored in y, then rotated)
CAP-TH_BD6.3-P2.50-D0.5-FD
  round 1.5 hole 0.9: 1(-1.25,0) 2(1.25,0)
CAP-TH_BD8.0-P3.50-D0.6-FD-2
  round 1.6 hole 1: 1(-1.75,0) 2(1.75,0)
CAP-TH_L4.0-W2.5-P2.50-D0.5
  round 1.4 hole 0.8: 1(-1.25,0) 2(1.25,0)
CAP-TH_L4.0-W2.6-P2.50-D0.5
  round 1.524 hole 0.914: 1(-1.25,0) 2(1.25,0)
CAP-TH_L4.2-W3.5-P2.54-D0.5
  round 1.4 hole 0.8: 1(-1.27,0) 2(1.27,0)
CAP-TH_L5.8-W2.4-P2.54-D0.6
  round 1.65 hole 1.1: 1(-1.27,0) 2(1.27,0)
CAP-TH_L5.8-W3.6-P5.0-D0.6
  round 1.3 hole 0.8: 1(-2.5,0) 2(2.5,0)
CONN-TH_2P-P2.50_BX-XH2.54-2PZZ
  rect 1.524x1.524 hole 0.914: 1(-1.25,0)
  round 1.524 hole 0.914: 2(1.25,0)
CONN-TH_4P-P2.50_4PIN
  rect 1.524x1.6 hole 1.1: 1(-3.75,0)
  round 1.6 hole 1.1: 2(-1.25,0) 3(1.25,0) 4(3.75,0)
CONN-TH_5P-P2.50_ZHOURI_XH-5PA
  round 1.6 hole 1: 1(-5,0) 2(-2.5,0) 3(0,0) 4(2.5,0) 5(5,0)
CONN-TH_5P-P2.50_ZX-XH2.54-5PZZ
  rect 1.524x1.6 hole 1.1: 1(-5,0)
  round 1.6 hole 1.1: 2(-2.5,0) 3(0,0) 4(2.5,0) 5(5,0)
ED-TH_BD5.8-P2.54-R-FD
  rect 1.212x1.212 hole 0.813: 1(1.27,0) 2(-1.27,0)
HDR-TH_2P-P2.54-V-M-1
  rect 1.8x1.8 hole 1.1: 1(-1.27,0)
  round 1.8 hole 1.1: 2(1.27,0)
HDR-TH_10P-P2.54-V-M-1
  rect 1.575x1.7 hole 1.1: 1(-11.43,0)
  round 1.7 hole 1.1: 2(-8.89,0) 3(-6.35,0) 4(-3.81,0) 5(-1.27,0) 6(1.27,0) 7(3.81,0) 8(6.35,0) 9(8.89,0) 10(11.43,0)
HDR-TH_22P-P2.54-V-F
  rect 1.6x1.6 hole 1.05: 1(-26.67,0)
  round 1.6 hole 1.05: 2(-24.13,0) 3(-21.59,0) 4(-19.05,0) 5(-16.51,0) 6(-13.97,0) 7(-11.43,0) 8(-8.89,0) 9(-6.35,0) 10(-3.81,0) 11(-1.27,0) 12(1.27,0) 13(3.81,0) 14(6.35,0) 15(8.89,0) 16(11.43,0) 17(13.97,0) 18(16.51,0) 19(19.05,0) 20(21.59,0) 21(24.13,0) 22(26.67,0)
HDR-TH_HC-PM254-5.0H-1X6PZ
  round 1.524 hole 1.1: 1(-6.35,0) 2(-3.81,0) 3(-1.27,0) 4(1.27,0) 5(3.81,0) 6(6.35,0)
IND-SMD_L5.7-W5.2_GSM0530
  rect 1.5x2.7 smd: 1(-2.25,0) 2(2.25,0)
Pad_e331
  round 2.2 hole 3.2: 3(0,0)
Pad_e372
  round 2.2 hole 3.2: 3(0,0)
PDIP-16_L19.3-W6.4-P2.54-LS7.9-BL
  rect 1.7x1.7 hole 1: 1(-8.89,-3.97)
  round 1.7 hole 1: 2(-6.35,-3.97) 3(-3.81,-3.97) 4(-1.27,-3.97) 5(1.27,-3.97) 6(3.81,-3.97) 7(6.35,-3.97) 8(8.89,-3.97) 9(8.89,3.97) 10(6.35,3.97) 11(3.81,3.97) 12(1.27,3.97) 13(-1.27,3.97) 14(-3.81,3.97) 15(-6.35,3.97) 16(-8.89,3.97)
RES-TH_BD2.2-L6.5-P10.50-D0.6
  round 1.6 hole 0.914: 1(-5.25,0) 2(5.25,0)
RES-TH_BD2.3-L6.5-P10.50-D0.5
  round 1.4 hole 0.7: 1(-5.25,0) 2(5.25,0)
RES-TH_BD2.5-L6.5-P10.50-D0.6
  round 1.879 hole 1: 1(-5.25,0) 2(5.25,0)
RES-TH_BD2.7-L6.2-P10.20-D0.4
  round 1.4 hole 0.8: 1(-5.1,0) 2(5.1,0)
SOT-23-6_L2.9-W1.6-P0.95-LS2.8-BL
  rect 0.532x1.072 smd: 1(-0.95,-1.149) 2(0,-1.149) 3(0.95,-1.149) 4(0.95,1.149) 5(0,1.149) 6(-0.95,1.149)

## Nets
As in the schematic, except:
GND: 5VIN.22 Battery.1 C2.1 C3.2 C6.1 C8.2 C9.1 C10.2 C11.2 C12.2 C13.2 EC11.3 EC11.4 GND.1 GND.21 GND.22 IN4 IN3 GND VCC IN2 IN1.3 LED1.1 OLED.1 R0.2 SENSOR.2 U5.2 ULN2003.8
VDD_VIN: Battery.2 C2.2 C3.1 C6.2 C9.2 C10.1 IN4 IN3 GND VCC IN2 IN1.4 R1.2 R12.1 Stepper.1 U5.5 ULN2003.9
DRV8833_AIN1: 5VIN.10 IN4 IN3 GND VCC IN2 IN1.6
DRV8833_AIN2: 5VIN.9 IN4 IN3 GND VCC IN2 IN1.5
DRV8833_OUT1: EEP O1  O2 O3  O4 ULT.5 MT_SOCKET.2
DRV8833_OUT2: EEP O1  O2 O3  O4 ULT.4 MT_SOCKET.1
ESP32_3.3V_1: 5VIN.2 EEP O1  O2 O3  O4 ULT.6
OLED_SCL: 5VIN.4 OLED.3

Pads without a net: 5VIN 3 6 7 8 11 12 13 16; EEP O1  O2 O3  O4 ULT 1 2 3; GND 2 3 4 5 19 20; IN4 IN3 GND VCC IN2 IN1 1 2; NOREF 3; NOREF#2 3; ULN2003 5 6 7 10 11 12

## Via types
v1: diameter 0.61, hole 0.305, Top Layer to Bottom Layer, 23 vias

## Routing (per net, layer and track width the routed paths; a pad name or vN(x,y) marks a point on that pad's centre or on a via; arc(x,y) is an arc through that point)
GND: length 37.7
  Top Layer w0.5: v1(24.38,61.5) 24.4,61.48 C8.2 ; Battery.1 22.22,68.97 v1(22.22,67.59) ; GND.22 57.4,3.71 v1(58.93,3.71) ; C6.1 v1(15.88,56.65) ; v1(35.43,67.59) 35.43,69.06 35.37,69.12 ; v1(11.56,69.75) 11.54,69.73 C3.2 ; LED1.1 v1(2.54,69.75) ; v1(55.25,57.05) 57.15,57.05 GND.1 ; C13.2 v1(52.07,36.48) ; C9.1 v1(10.03,24.29) ; R0.2 v1(7.49,22.87) ; 5VIN.22 v1(33.91,3.84) ; U5.2 v1(10.41,53.62) ; C10.2 v1(27.28,40.54) ; C2.1 v1(15.37,71.02) ; ULN2003.8 v1(22.48,28.35) ; GND.21 v1(59.06,6.38)
  Bottom Layer w0.5: 46.35,68.99 v1(46.35,66.7) ; 43.85,68.99 v1(43.85,66.7) ; C11.2 v1(60.58,17.43) ; IN4 IN3 GND VCC IN2 IN1.3 v1(16.38,39.65) ; SENSOR.2 v1(20.47,5.24) ; C12.2 v1(50.04,25.94)
VDD_5V: length 129.4
  Top Layer w0.5: C1.1 8.76,60.64 9.53,61.41 ; SENSOR.1 17.97,5.17 19.18,6.38 5VIN.21 38.74,6.38 40.89,8.54 40.89,61.38 40.39,61.88 26.92,61.88 26.9,61.9 ; 26.9,61.9 C8.1 26.9,58.65 L2.2 ; 26.9,61.9 24.57,64.23 20.26,64.23 17.53,61.5 9.62,61.5 9.53,61.41 ; 9.53,61.41 R3.2
VDD_VIN: length 111.6
  Top Layer w0.5: Battery.2 17.93,67.21 C2.2 ; C2.2 10.43,67.21 C3.1 ; C2.2 15.37,65.9 R1.2 ; C6.2 16.74,53.62 U5.5
  Top Layer w0.8: C9.2 10.03,31.65 15.49,37.11 IN4 IN3 GND VCC IN2 IN1.4 22,37.11 C10.1 ; C9.2 5.46,28.35 3.68,26.57 3.68,8.92 4.49,8.11 8.89,8.11 ; C9.2 ULN2003.9
  Bottom Layer w0.8: 20.96,56.42 20.96,56.29 18.82,54.15 C6.2 ; 20.96,56.42 24.13,53.24 24.13,39.25 C10.1 ; 20.96,56.42 20.96,65.69 19.71,66.94 Battery.2
COUNTER_D0: length 67.3
  Top Layer w0.254: 5VIN.15 37.08,21.62 38.86,23.4 R9.1
  Bottom Layer w0.254: SENSOR.4 25.47,2.12 26.42,1.17 35.56,1.17 36.96,2.57 36.96,19.97 35.31,21.62 5VIN.15
DRV8833_AIN1: length 14.8
  Top Layer w0.254: 5VIN.10 30.1,34.32 27.81,32.03 IN4 IN3 GND VCC IN2 IN1.6
DRV8833_AIN2: length 14.8
  Top Layer w0.254: 5VIN.9 29.97,36.86 27.69,34.57 IN4 IN3 GND VCC IN2 IN1.5
DRV8833_OUT1: length 12.9
  Top Layer w0.254: MT_SOCKET.2 2.61,51.77 0.94,51.77 0.76,51.59 0.76,43.34 1.91,42.19 EEP O1  O2 O3  O4 ULT.5
DRV8833_OUT2: length 13.7
  Bottom Layer w0.254: EEP O1  O2 O3  O4 ULT.4 4.44,39.65 6.1,41.31 6.1,46.77 3.81,49.05 MT_SOCKET.1
EMPTY_SENSOR: length 54.1
  Top Layer w0.254: 5VIN.14 32,24.29 35.31,24.29 35.81,24.8 R8.1
  Bottom Layer w0.254: SENSOR.3 22.97,5.22 27.56,9.81 27.56,23.78 27.94,24.16 5VIN.14
ENCODER_A: length 69.7
  Bottom Layer w0.254: 53.59,20.48 53.59,25.68 52.07,27.21 C13.1 ; 53.59,20.48 52.32,21.75 48.39,21.75 48.13,22 48.13,62.01 51.35,65.23 51.35,68.99 ; 53.59,20.48 R16.1 57.07,18.87 GND.16
ENCODER_B: length 69
  Bottom Layer w0.254: R15.1 53.47,14.81 54.61,15.95 54.61,16.29 54.79,16.47 57.2,16.47 GND.17 ; R15.1 46.74,18.11 46.74,62.77 48.85,64.89 48.85,68.99 ; R15.1 C12.1
ENCODER_SW: length 75.2
  Bottom Layer w0.254: C11.1 60.37,14 GND.18 54.99,14 51.82,10.82 47.5,10.82 47.37,10.95 R14.1 45.09,15.69 45.09,61.62 41.35,65.36 41.35,68.99
ESP32_3.3V: length 89.3
  Bottom Layer w0.5: 32.89,58.2 32.89,68.97 OLED.2 ; 32.89,58.2 5VIN.1 ; 32.89,58.2 33.89,57.2 R8.2 R9.2 41.76,57.2 42.93,56.04 42.93,6 46.02,2.91 R14.2 48.64,2.91 R15.2 52.79,4.31 53.59,5.11 R16.2
ESP32_3.3V_1: length 37
  Top Layer w0.254: 5VIN.2 30.23,54.64 28.57,52.99 28.57,49.81 26.67,47.91 15.75,47.91 10.16,42.32 8.13,42.32 5.72,44.73 EEP O1  O2 O3  O4 ULT.6
OLED_SCL: length 21.4
  Bottom Layer w0.254: 5VIN.4 30.48,49.56 29.72,50.32 29.72,63.78 30.37,64.44 OLED.3
OLED_SDA: length 24.9
  Bottom Layer w0.254: 5VIN.5 29.72,47.02 28.83,47.91 28.83,64.04 27.87,64.99 OLED.4
RESERVE_1: length 3.4
  Top Layer w0.254: GND.6 pin.1
RESERVE_2: length 3.4
  Top Layer w0.254: GND.7 pin.2
RESERVE_3: length 3.4
  Top Layer w0.254: GND.8 pin.3
RESERVE_4: length 3.4
  Top Layer w0.254: GND.9 pin.4
RESERVE_5: length 3.4
  Top Layer w0.254: GND.10 pin.5
RESERVE_6: length 3.4
  Top Layer w0.254: GND.11 pin.6
RESERVE_7: length 3.4
  Top Layer w0.254: GND.12 pin.7
RESERVE_8: length 3.4
  Top Layer w0.254: GND.13 pin.8
RESERVE_9: length 3.4
  Top Layer w0.254: GND.14 pin.9
RESERVE_10: length 3.4
  Top Layer w0.254: GND.15 pin.10
ULN2003_IN1: length 8.5
  Top Layer w0.254: ULN2003.1 27.81,10.57 29.59,8.79 31.75,8.79 5VIN.20
ULN2003_IN2: length 8.4
  Top Layer w0.254: 5VIN.19 29.46,11.46 27.81,13.11 ULN2003.2
ULN2003_IN3: length 8.4
  Top Layer w0.254: 5VIN.18 29.84,14 28.19,15.65 ULN2003.3
ULN2003_IN4: length 8.4
  Top Layer w0.254: 5VIN.17 30.1,16.54 28.45,18.19 ULN2003.4
$1N9: length 7.4
  Top Layer w0.254: ULN2003.13 16.14,18.11 Stepper.5
$1N11: length 7.3
  Top Layer w0.254: ULN2003.14 16.18,15.61 Stepper.4
$1N12: length 7.3
  Top Layer w0.254: Stepper.3 ULN2003.15
$1N13: length 7.3
  Top Layer w0.254: ULN2003.16 16.18,10.61 8.89,10.61
$4N6: length 4
  Top Layer w0.5: R1.1 3.68,64.72 LED1.2
$4N17: length 8.3
  Top Layer w0.254: U5.4 14.28,52.67 16.66,50.3 R12.2
$4N20: length 12.2
  Top Layer w0.254: R3.1 6.92,50.91 C1.2 ; U5.3 8.84,52.67 C1.2 ; C1.2 R2.1
$4N23: length 20
  Top Layer w0.254: L2.1 25.36,52.68 23.29,52.68 23.11,52.86 23.11,54.13 17.78,59.47 C7.1 13.72,59.22 U5.6
$4N24: length 4.9
  Top Layer w0.254: U5.1 11.42,59.33 11.43,59.34 C7.2
$4N2655: length 4.7
  Top Layer w0.254: R0.1 6.22,34.15 R2.2

## Copper pours and planes (outline as drawn; the poured copper is in the pictures)
GND on Top Layer: -0.13,72.86 62.51,72.86 62.51,0 -0.13,0
GND on Bottom Layer: 0,72.86 62.63,72.86 62.63,0 0,0

## Text on the board
Bottom Silkscreen Layer: JackPokerV2.0
Top Silkscreen Layer: 3.3 | 42 | 45 | VIN | RST | 46 | 14 | 17 | 18 | 12 | 13 | 10 | 11 | 4 | 5 | 16 | 6 | 7 | 8 | 3 | 9 | 15 | 40 | 38 | 37 | 35 | 39 | 36 | 41 | 0 | 47 | 48 | 21 | 20 | 19 | TX | RX | 1 | 2 | GND | 5V  GND EMP CNT | VIN GND | SDA SCL 3.3V GND | E(SW) | D | C | B | A
